# Altium project bailey.PrjPcb (part 6 of 11)
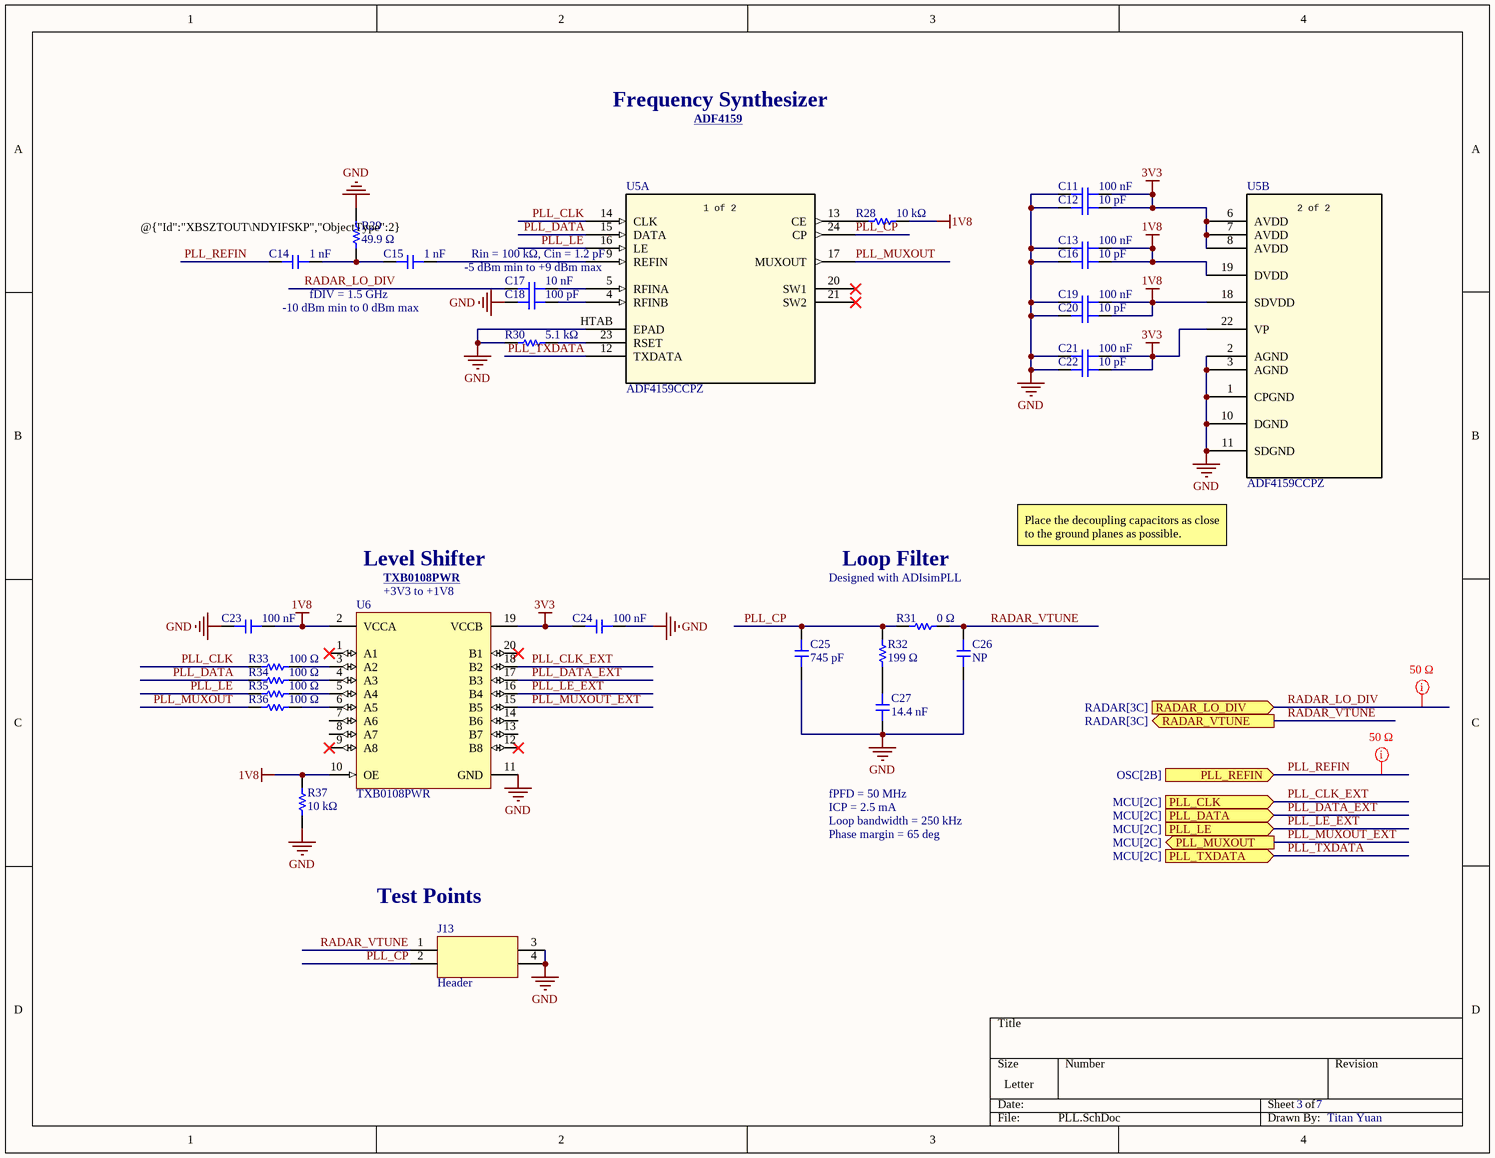
[diagram p11: PLL.SchDoc]

## Sheet PLL.SchDoc (continued)

### Library data of the parts (continued)
U5 = ADF4159CCPZ: IC Pll Freq Synthesizer 24LFCSP "IC 13GHZ 1 24-WFQFN Exposed Pad, Csp"; Manufacturer_Name: Analog Devices Inc; Manufacturer: Analog Devices; Manufacturer Lifecycle Status: PRODUCTION; Input: CMOS; Max Supply Current: 40mA; Max Supply Voltage: 3.45V; Min Supply Voltage: 2.7V; Nominal Supply Current: 33mA; Number of Circuits: 1; PLL: Yes; Copyright: Copyright (C) 2025 Ultra Librarian. All rights reserved.; Manufacturer_Part_Number: ADF4159CCPZ; RefDes: RefDes; Type: Type; Supplier: Arrow Electronics; Supplier Part Number: ADF4159CCPZ; Manufacturer Part Number: ADF4159CCPZ; RoHS: Compliant; Category: Clock Generators, PLLs, Frequency Synthesizers; Stock: 16; Pricing: 1=14.01, 10=12.76 (USD); Case/Package: LFCSP EP; Frequency: 13GHz; Height: 750µm; Lead Free: Contains Lead; Length: 4.1mm; Lifecycle Status: Production; Clock Frequency: 13GHz; Max Operating Temperature: 125°C; Min Operating Temperature: -40°C; Mounting Technology: Surface Mount; Number of Outputs: 1; Pins: 24; Operating Supply Current: 40mA; Radiation Hardening: No; REACH SVHC: No; Schedule B: 8542390000, 8542390000|8542390000|8542390000|8542390000|8542390000|8542390000|8542390000|8542390000|8542390000|8542390000|8542390000|8542390000|8542390000|8542390000|8542390000|8542390000|8542390000|8542390000|8542390000|8542390000|8542390000|8542390000|8542390000|85; Width: 4.1mm; ComponentLink1URL: https://datasheet.octopart.com:443/ADF4159CCPZ-Analog-Devices-datasheet-28359207.pdf?src-supplier=Newark; ComponentLink1Description: https://datasheet.octopart.com:443/ADF4159CCPZ-Analog-Devices-datasheet-28359207.pdf?src-supplier=Newark; ComponentLink2URL: https://datasheet.octopart.com:443/ADF4159CCPZ-Analog-Devices-datasheet-23761417.pdf?src-supplier=Newark; ComponentLink2Description: https://datasheet.octopart.com:443/ADF4159CCPZ-Analog-Devices-datasheet-23761417.pdf?src-supplier=Newark; ComponentLink3URL: https://datasheet.octopart.com:443/ADF4159CCPZ-Analog-Devices-datasheet-11761967.pdf?src-supplier=Newark; ComponentLink3Description: https://datasheet.octopart.com:443/ADF4159CCPZ-Analog-Devices-datasheet-11761967.pdf?src-supplier=Newark; ComponentLink4URL: https://octopart.com:443/opatz8j6/c1?t=sFpxmdEK-TpWxew3lQPHWXAdM5czz84jkTjdAblxL2FLtgSnnJtHzcZ7eDVrY5wUr_SVqsz_Dp2fz8ZtN6lVO8uzYTTInUBy26MK382qZeiAUDaS88UR4ELIN2ZU7XFIVaK4UL8ObL4flxWtc7ks8pYJfkdBDqO7QR7iH-p_7135f50wuHOzpbmA4pBW-bckYVq5mgo5pYPHvD0dMhS4_c77dJySLl7uu4XVnigltr6SOw_ybHZCS7HIqQ2lc5ypX2E6NLk_TCC2erJi_2-Ybzi1S5UkxB_CfPGHcszzu0v9JbzFJPfherc&src-supplier=Analog+Devices; ComponentLink4Description: https://octopart.com:443/opatz8j6/c1?t=sFpxmdEK-TpWxew3lQPHWXAdM5czz84jkTjdAblxL2FLtgSnnJtHzcZ7eDVrY5wUr_SVqsz_Dp2fz8ZtN6lVO8uzYTTInUBy26MK382qZeiAUDaS88UR4ELIN2ZU7XFIVaK4UL8ObL4flxWtc7ks8pYJfkdBDqO7QR7iH-p_7135f50wuHOzpbmA4pBW-bckYVq5mgo5pYPHvD0dMhS4_c77dJySLl7uu4XVnigltr6SOw_ybHZCS7HIqQ2lc5ypX2E6NLk_TCC2erJi_2-Ybzi1S5UkxB_CfPGHcszzu0v9JbzFJPfherc&src-supplier=Analog+Devices; ComponentLink5URL: https://datasheet.octopart.com:443/ADF4159CCPZ-Analog-Devices-datasheet-101563325.pdf?src-supplier=Augswan; ComponentLink5Description: https://datasheet.octopart.com:443/ADF4159CCPZ-Analog-Devices-datasheet-101563325.pdf?src-supplier=Augswan; ComponentLink6URL: https://datasheet.octopart.com:443/ADF4159CCPZ-Analog-Devices-datasheet-16077098.pdf?src-supplier=element14+APAC; ComponentLink6Description: https://datasheet.octopart.com:443/ADF4159CCPZ-Analog-Devices-datasheet-16077098.pdf?src-supplier=element14+APAC; ComponentLink7URL: https://datasheet.octopart.com:443/ADF4159CCPZ-Analog-Devices-datasheet-140566762.pdf?src-supplier=Arrow.cn; ComponentLink7Description: https://datasheet.octopart.com:443/ADF4159CCPZ-Analog-Devices-datasheet-140566762.pdf?src-supplier=Arrow.cn; ComponentLink8URL: http://sigma.octopart.com:80/conflict_mineral_statement/Analog-Devices-company-33.pdf?src-supplier=Compliance+Statements; ComponentLink8Description: http://sigma.octopart.com:80/conflict_mineral_statement/Analog-Devices-company-33.pdf?src-supplier=Compliance+Statements; ComponentLink9URL: https://octopart.com:443/opatz8j6/c1?t=4AUWQOYY8hDK56fWYIFCkzZGK-WlRlfj3W59qJ6lN0Or0dqBi-BZtouAdLLcZ0g9GpUibARjvwKelFok923HesNjOwvjJbGuJIFFDtkFLQoAtw9O0oSsPiBrvEsgVLQ8yyZZa0MUOvDC9pb6dfm0a_5Zj_Vp7K3DrxroK-yAUp5WMn8ukNugC5wnzgVIb4QKMMJ7PwoxZFfV1QgXJzgUp4ZWxSHfn6Mn-DyBM67ES7wx5acptrPz2a-iVPxqbhd_bTw80SeUQ9yQIgwDbxKtCFSTQqp_tPFf7XLfJysxGOlPYb3Go66K7jI&src-supplier=Compliance+Statements; ComponentLink9Description: https://octopart.com:443/opatz8j6/c1?t=4AUWQOYY8hDK56fWYIFCkzZGK-WlRlfj3W59qJ6lN0Or0dqBi-BZtouAdLLcZ0g9GpUibARjvwKelFok923HesNjOwvjJbGuJIFFDtkFLQoAtw9O0oSsPiBrvEsgVLQ8yyZZa0MUOvDC9pb6dfm0a_5Zj_Vp7K3DrxroK-yAUp5WMn8ukNugC5wnzgVIb4QKMMJ7PwoxZFfV1QgXJzgUp4ZWxSHfn6Mn-DyBM67ES7wx5acptrPz2a-iVPxqbhd_bTw80SeUQ9yQIgwDbxKtCFSTQqp_tPFf7XLfJysxGOlPYb3Go66K7jI&src-supplier=Compliance+Statements
U6 = TXB0108PWR: 8-Bit Bidirectional Voltage-Level Shifter with Auto Direction Sensing and +/-15-kV ESD Protect 20-TSSOP -40 to 85; Manufacturer: Texas Instruments; Manufacturer Lifecycle Status: ACTIVE; Manufacturer Package Identifier: PW (R-PDSO-G**); Data Rate: 100Mbps; High Level Output Current: -20µA; Logic Function: Translator; Low Level Output Current: 20µA; Max Supply Voltage: 5.5V; Min Supply Voltage: 1.65V; Number of Bits: 8; Propagation Delay: 4ns; Quiescent Current: 3.5µA; Rise Time: 7.3ns; Topology: Push-Pull; Turn-On Delay Time: 9.5ns; Manufacturer Part Number: TXB0108PWR; Supplier: DigiKey; Supplier Part Number: 296-21527-1-ND; RoHS: Compliant; Category: Voltage Level Shifters; Stock: 22043; Pricing: 1=1.82, 10=1.338, 25=1.2176, 100=1.0851, 250=1.02184, 500=1.01132 (USD); Case/Package: TSSOP; Contact Plating: Gold; Height: 0m; Lead Free: Lead Free; Length: 6.5mm; Lifecycle Status: Production; Max Operating Temperature: 85°C; Min Operating Temperature: -40°C; Mounting Technology: Surface Mount; Number of Channels: 8; Number of Inputs: 8; Pins: 20; Output Current: 20µA; Radiation Hardening: No; REACH SVHC: No; Schedule B: 8542390000, 8542390000|8542390000|8542390000|8542390000|8542390000; Termination: SMD/SMT; Thickness: 1mm; Weight: 76.997305mg; Width: 4.4mm; ComponentLink1URL: https://sigma.octopart.com:443/157851284/technical_drawing/Texas-Instruments-TXB0108PWR.pdf?src-supplier=Texas+Instruments; ComponentLink1Description: https://sigma.octopart.com:443/157851284/technical_drawing/Texas-Instruments-TXB0108PWR.pdf?src-supplier=Texas+Instruments; ComponentLink2URL: https://octopart.com:443/opatz8j6/c1?t=LySuUYxN9QFMmqSZ0iSTBK1M-CfND3iA45F57-rgipnbsICCknTkoBhUukg2AkZDEL0aXzWd55iRogxa7qKL4TXUNFi6ipSyGXAAa9LZBdmP_Kv4vGBHh0qj-vgKaBFsF-d5KwYEI23cSnz-pp69Sgcy-_vsa0CB7mKhHXjctGx33TVX4QZBqIYpXxZkCgRNByv7fiJueXud0UX45YityO0p_-WYUGRJV_eJOGa4Ay7QQ8FZc3uEUNlVrkxXjQZMNFnbfnrSKCgesFBqhoNiKT25AC3yNUdmgJ7FLN5_z4zOzP0RR75DYkH4GMBnBzaYVRF7L7HNXVjS4Tp9-MFjD_sEQ-aCybQglHE52PnZL4JsgTDjFwelFwDtaMk_UKSdWjy_&src-supplier=Texas+Instruments; ComponentLink2Description: https://octopart.com:443/opatz8j6/c1?t=LySuUYxN9QFMmqSZ0iSTBK1M-CfND3iA45F57-rgipnbsICCknTkoBhUukg2AkZDEL0aXzWd55iRogxa7qKL4TXUNFi6ipSyGXAAa9LZBdmP_Kv4vGBHh0qj-vgKaBFsF-d5KwYEI23cSnz-pp69Sgcy-_vsa0CB7mKhHXjctGx33TVX4QZBqIYpXxZkCgRNByv7fiJueXud0UX45YityO0p_-WYUGRJV_eJOGa4Ay7QQ8FZc3uEUNlVrkxXjQZMNFnbfnrSKCgesFBqhoNiKT25AC3yNUdmgJ7FLN5_z4zOzP0RR75DYkH4GMBnBzaYVRF7L7HNXVjS4Tp9-MFjD_sEQ-aCybQglHE52PnZL4JsgTDjFwelFwDtaMk_UKSdWjy_&src-supplier=Texas+Instruments; ComponentLink3URL: https://datasheet.octopart.com:443/TXB0108PWR-Texas-Instruments-datasheet-34148259.pdf?src-supplier=Texas+Instruments; ComponentLink3Description: https://datasheet.octopart.com:443/TXB0108PWR-Texas-Instruments-datasheet-34148259.pdf?src-supplier=Texas+Instruments; ComponentLink4URL: https://datasheet.octopart.com:443/TXB0108PWR-Texas-Instruments-datasheet-11474939.pdf?src-supplier=Texas+Instruments; ComponentLink4Description: https://datasheet.octopart.com:443/TXB0108PWR-Texas-Instruments-datasheet-11474939.pdf?src-supplier=Texas+Instruments; ComponentLink5URL: https://datasheet.octopart.com:443/TXB0108PWR-Texas-Instruments-datasheet-10384694.pdf?src-supplier=Texas+Instruments; ComponentLink5Description: https://datasheet.octopart.com:443/TXB0108PWR-Texas-Instruments-datasheet-10384694.pdf?src-supplier=Texas+Instruments; ComponentLink6URL: https://datasheet.octopart.com:443/TXB0108PWR-Texas-Instruments-datasheet-10258393.pdf?src-supplier=Texas+Instruments; ComponentLink6Description: https://datasheet.octopart.com:443/TXB0108PWR-Texas-Instruments-datasheet-10258393.pdf?src-supplier=Texas+Instruments; ComponentLink7URL: https://sigma.octopart.com:443/49249835/technical_drawing/Texas-Instruments-TXB0108PWR.pdf?src-supplier=Texas+Instruments; ComponentLink7Description: https://sigma.octopart.com:443/49249835/technical_drawing/Texas-Instruments-TXB0108PWR.pdf?src-supplier=Texas+Instruments; ComponentLink8URL: https://datasheet.octopart.com:443/TXB0108PWR-Texas-Instruments-datasheet-37744618.pdf?src-supplier=Farnell; ComponentLink8Description: https://datasheet.octopart.com:443/TXB0108PWR-Texas-Instruments-datasheet-37744618.pdf?src-supplier=Farnell; ComponentLink9URL: https://datasheet.octopart.com:443/TXB0108PWR-Texas-Instruments-datasheet-8559414.pdf?src-supplier=Farnell; ComponentLink9Description: https://datasheet.octopart.com:443/TXB0108PWR-Texas-Instruments-datasheet-8559414.pdf?src-supplier=Farnell; ComponentLink10URL: https://datasheet.octopart.com:443/TXB0108PWR-Texas-Instruments-datasheet-5368061.pdf?src-supplier=Farnell; ComponentLink10Description: https://datasheet.octopart.com:443/TXB0108PWR-Texas-Instruments-datasheet-5368061.pdf?src-supplier=Farnell; ComponentLink11URL: https://datasheet.octopart.com:443/TXB0108PWR-Texas-Instruments-datasheet-66618004.pdf?src-supplier=Farnell; ComponentLink11Description: https://datasheet.octopart.com:443/TXB0108PWR-Texas-Instruments-datasheet-66618004.pdf?src-supplier=Farnell; ComponentLink12URL: https://datasheet.octopart.com:443/TXB0108PWR-Texas-Instruments-datasheet-48033010.pdf?src-supplier=Farnell; ComponentLink12Description: https://datasheet.octopart.com:443/TXB0108PWR-Texas-Instruments-datasheet-48033010.pdf?src-supplier=Farnell; ComponentLink13URL: https://datasheet.octopart.com:443/TXB0108PWR-Texas-Instruments-datasheet-10542789.pdf?src-supplier=Farnell; ComponentLink13Description: https://datasheet.octopart.com:443/TXB0108PWR-Texas-Instruments-datasheet-10542789.pdf?src-supplier=Farnell; ComponentLink14URL: https://datasheet.octopart.com:443/TXB0108PWR-Texas-Instruments-datasheet-151942.pdf?src-supplier=Upverter; ComponentLink14Description: https://datasheet.octopart.com:443/TXB0108PWR-Texas-Instruments-datasheet-151942.pdf?src-supplier=Upverter; ComponentLink15URL: https://datasheet.octopart.com:443/TXB0108PWR-Texas-Instruments-datasheet-11536343.pdf?src-supplier=Upverter; ComponentLink15Description: https://datasheet.octopart.com:443/TXB0108PWR-Texas-Instruments-datasheet-11536343.pdf?src-supplier=Upverter; ComponentLink16URL: https://datasheet.octopart.com:443/TXB0108PWR-Texas-Instruments-datasheet-33012939.pdf?src-supplier=element14+APAC; ComponentLink16Description: https://datasheet.octopart.com:443/TXB0108PWR-Texas-Instruments-datasheet-33012939.pdf?src-supplier=element14+APAC; ComponentLink17URL: https://datasheet.octopart.com:443/TXB0108PWR-Texas-Instruments-datasheet-165804950.pdf?src-supplier=LCSC; ComponentLink17Description: https://datasheet.octopart.com:443/TXB0108PWR-Texas-Instruments-datasheet-165804950.pdf?src-supplier=LCSC; ComponentLink18URL: https://datasheet.octopart.com:443/TXB0108PWR-Texas-Instruments-datasheet-159118386.pdf?src-supplier=LCSC; ComponentLink18Description: https://datasheet.octopart.com:443/TXB0108PWR-Texas-Instruments-datasheet-159118386.pdf?src-supplier=LCSC; ComponentLink19URL: https://datasheet.octopart.com:443/TXB0108PWR-Texas-Instruments-datasheet-137316104.pdf?src-supplier=Future+Electronics; ComponentLink19Description: https://datasheet.octopart.com:443/TXB0108PWR-Texas-Instruments-datasheet-137316104.pdf?src-supplier=Future+Electronics; ComponentLink20URL: https://datasheet.octopart.com:443/TXB0108PWR-Texas-Instruments-datasheet-14151550.pdf?src-supplier=iiiC; ComponentLink20Description: https://datasheet.octopart.com:443/TXB0108PWR-Texas-Instruments-datasheet-14151550.pdf?src-supplier=iiiC; ComponentLink21URL: https://datasheet.octopart.com:443/TXB0108PWR-Texas-Instruments-datasheet-126938.pdf?src-supplier=DigiKey; ComponentLink21Description: https://datasheet.octopart.com:443/TXB0108PWR-Texas-Instruments-datasheet-126938.pdf?src-supplier=DigiKey; ComponentLink22URL: http://sigma.octopart.com:80/reach_statement/Texas-Instruments-company-64.pdf?src-supplier=Compliance+Statements; ComponentLink22Description: http://sigma.octopart.com:80/reach_statement/Texas-Instruments-company-64.pdf?src-supplier=Compliance+Statements; ComponentLink23URL: http://sigma.octopart.com:80/conflict_mineral_statement/Texas-Instruments-company-63.pdf?src-supplier=Compliance+Statements; ComponentLink23Description: http://sigma.octopart.com:80/conflict_mineral_statement/Texas-Instruments-company-63.pdf?src-supplier=Compliance+Statements

## Sheet ADC.SchDoc
size Letter; DrawnBy: Titan Yuan; DocumentNumber: 4; SheetNumber: 4; SheetTotal: 7
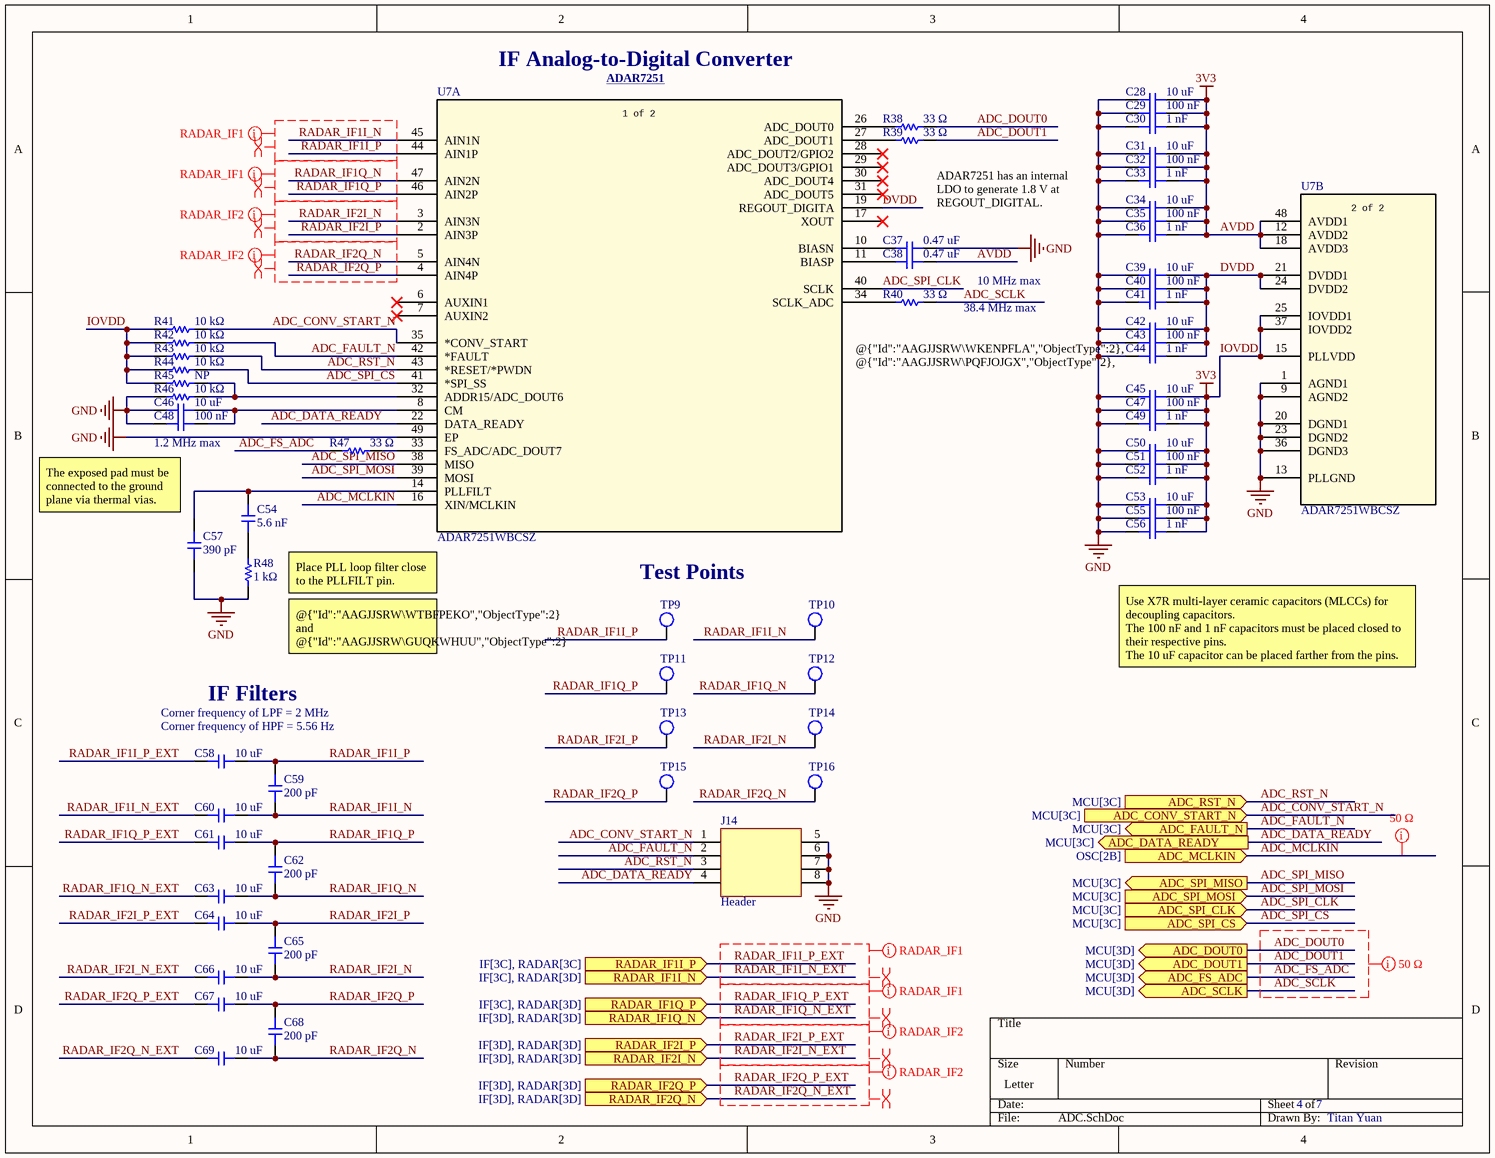
[diagram p3: ADC.SchDoc]

### Parts
C28  10 uF  [CAP_0805]
C29  100 nF  [CAP_0402]
C30  1 nF  [CAP_0402]
C31  10 uF  [CAP_0805]
C32  100 nF  [CAP_0402]
C33  1 nF  [CAP_0402]
C34  10 uF  [CAP_0805]
C35  100 nF  [CAP_0402]
C36  1 nF  [CAP_0402]
C37  0.47 uF  [CAP_0402]
C38  0.47 uF  [CAP_0402]
C39  10 uF  [CAP_0805]
C40  100 nF  [CAP_0402]
C41  1 nF  [CAP_0402]
C42  10 uF  [CAP_0805]
C43  100 nF  [CAP_0402]
C44  1 nF  [CAP_0402]
C45  10 uF  [CAP_0805]
C46  10 uF  [CAP_0805]
C47  100 nF  [CAP_0402]
C48  100 nF  [CAP_0402]
C49  1 nF  [CAP_0402]
C50  10 uF  [CAP_0805]
C51  100 nF  [CAP_0402]
C52  1 nF  [CAP_0402]
C53  10 uF  [CAP_0805]
C54  5.6 nF  [CAP_0402]
C55  100 nF  [CAP_0402]
C56  1 nF  [CAP_0402]
C57  390 pF  [CAP_0402]
C58  10 uF  [CAP_0805]
C59  200 pF  [CAP_0603]
C60  10 uF  [CAP_0805]
C61  10 uF  [CAP_0805]
C62  200 pF  [CAP_0603]
C63  10 uF  [CAP_0805]
C64  10 uF  [CAP_0805]
C65  200 pF  [CAP_0603]
C66  10 uF  [CAP_0805]
C67  10 uF  [CAP_0805]
C68  200 pF  [CAP_0603]
C69  10 uF  [CAP_0805]
J14  Header  [CONN_2x4_2.54mm_PinHeader_Vertical]
R38  33 Ω  [RES_0402]
R39  33 Ω  [RES_0402]
R40  33 Ω  [RES_0402]
R41  10 kΩ  [RES_0402]
R42  10 kΩ  [RES_0402]
R43  10 kΩ  [RES_0402]
R44  10 kΩ  [RES_0402]
R45  NP  [RES_0402]
R46  10 kΩ  [RES_0402]
R47  33 Ω  [RES_0402]
R48  1 kΩ  [RES_0402]
TP9  TEST_POINT  [TEST_POINT]  (value not drawn)
TP10  TEST_POINT  [TEST_POINT]  (value not drawn)
TP11  TEST_POINT  [TEST_POINT]  (value not drawn)
TP12  TEST_POINT  [TEST_POINT]  (value not drawn)
TP13  TEST_POINT  [TEST_POINT]  (value not drawn)
TP14  TEST_POINT  [TEST_POINT]  (value not drawn)
TP15  TEST_POINT  [TEST_POINT]  (value not drawn)
TP16  TEST_POINT  [TEST_POINT]  (value not drawn)
U7  ADAR7251WBCSZ  [CS_48_1_ADI]  (parts A,B of 2)

### Ports
ADC_CONV_START_N (in, see MCU[3C]), ADC_DATA_READY (out, see MCU[3C]), ADC_DOUT0 (out, see MCU[3D]), ADC_DOUT1 (out, see MCU[3D]), ADC_FAULT_N (out, see MCU[3C]), ADC_FS_ADC (out, see MCU[3D]), ADC_MCLKIN (in, see OSC[2B]), ADC_RST_N (in, see MCU[3C]), ADC_SCLK (out, see MCU[3D]), ADC_SPI_CLK (in, see MCU[3C]), ADC_SPI_CS (in, see MCU[3C]), ADC_SPI_MISO (out, see MCU[3C]), ADC_SPI_MOSI (in, see MCU[3C]), RADAR_IF1I_N (in, see IF[3C], RADAR[3D]), RADAR_IF1I_P (in, see IF[3C], RADAR[3C]), RADAR_IF1Q_N (in, see IF[3D], RADAR[3D]), RADAR_IF1Q_P (in, see IF[3C], RADAR[3D]), RADAR_IF2I_N (in, see IF[3D], RADAR[3D]), RADAR_IF2I_P (in, see IF[3D], RADAR[3D]), RADAR_IF2Q_N (in, see IF[3D], RADAR[3D]), RADAR_IF2Q_P (in, see IF[3D], RADAR[3D])

### Nets
AVDD: C28.2 C29.2 C30.2 C31.2 C32.2 C33.2 C34.2 C35.2 C36.2 C38.1 C45.2 C47.2 C49.2 C50.2 C51.2 C52.2 C53.2 C55.2 C56.2 R41.2 R42.2 R43.2 R44.2 R45.2 U7.12(AVDD2) U7.15(PLLVDD) U7.18(AVDD3) U7.25(IOVDD1) U7.37(IOVDD2) U7.48(AVDD1)  [also labelled 3V3, IOVDD]
GND: C28.1 C29.1 C30.1 C31.1 C32.1 C33.1 C34.1 C35.1 C36.1 C37.1 C39.1 C40.1 C41.1 C42.1 C43.1 C44.1 C45.1 C46.1 C47.1 C48.1 C49.1 C50.1 C51.1 C52.1 C53.1 C55.1 C56.1 C57.1 J14.5 J14.6 J14.7 J14.8 R46.2 R48.1 U7.1(AGND1) U7.9(AGND2) U7.13(PLLGND) U7.20(DGND1) U7.23(DGND2) U7.36(DGND3) U7.49(EP)
ADC_CONV_START_N: J14.1 R41.1 U7.35(*CONV_START) ; port ADC_CONV_START_N
ADC_DATA_READY: J14.4 U7.22(DATA_READY) ; port ADC_DATA_READY
ADC_DOUT0: R38.2 ; port ADC_DOUT0
ADC_DOUT1: R39.2 ; port ADC_DOUT1
ADC_FAULT_N: J14.2 R42.1 U7.42(*FAULT) ; port ADC_FAULT_N
ADC_FS_ADC: R47.1 ; port ADC_FS_ADC
ADC_MCLKIN: U7.16(XIN/MCLKIN) ; port ADC_MCLKIN
ADC_RST_N: J14.3 R43.1 U7.43(*RESET/*PWDN) ; port ADC_RST_N
ADC_SCLK: R40.2 ; port ADC_SCLK
ADC_SPI_CLK: U7.40(SCLK) ; port ADC_SPI_CLK
ADC_SPI_CS: R44.1 U7.41(*SPI_SS) ; port ADC_SPI_CS
ADC_SPI_MISO: U7.38(MISO) ; port ADC_SPI_MISO
ADC_SPI_MOSI: U7.39(MOSI) ; port ADC_SPI_MOSI
DVDD: C39.2 C40.2 C41.2 C42.2 C43.2 C44.2 U7.19(REGOUT_DIGITA) U7.21(DVDD1) U7.24(DVDD2)  [project net DVDD_4]
RADAR_IF1I_N: C59.1 C60.2 TP10.1 U7.45(AIN1N)  [project net RADAR_IF1I_N_4]
RADAR_IF1I_N_EXT: C60.1 ; port RADAR_IF1I_N  [project net RADAR_IF1I_N]
RADAR_IF1I_P: C58.2 C59.2 TP9.1 U7.44(AIN1P)  [project net RADAR_IF1I_P_4]
RADAR_IF1I_P_EXT: C58.1 ; port RADAR_IF1I_P  [project net RADAR_IF1I_P]
RADAR_IF1Q_N: C62.1 C63.2 TP12.1 U7.47(AIN2N)  [project net RADAR_IF1Q_N_4]
RADAR_IF1Q_N_EXT: C63.1 ; port RADAR_IF1Q_N  [project net RADAR_IF1Q_N]
RADAR_IF1Q_P: C61.2 C62.2 TP11.1 U7.46(AIN2P)  [project net RADAR_IF1Q_P_4]
RADAR_IF1Q_P_EXT: C61.1 ; port RADAR_IF1Q_P  [project net RADAR_IF1Q_P]
RADAR_IF2I_N: C65.1 C66.2 TP14.1 U7.3(AIN3N)  [project net RADAR_IF2I_N_4]
RADAR_IF2I_N_EXT: C66.1 ; port RADAR_IF2I_N  [project net RADAR_IF2I_N]
RADAR_IF2I_P: C64.2 C65.2 TP13.1 U7.2(AIN3P)  [project net RADAR_IF2I_P_4]
RADAR_IF2I_P_EXT: C64.1 ; port RADAR_IF2I_P  [project net RADAR_IF2I_P]
RADAR_IF2Q_N: C68.1 C69.2 TP16.1 U7.5(AIN4N)  [project net RADAR_IF2Q_N_4]
RADAR_IF2Q_N_EXT: C69.1 ; port RADAR_IF2Q_N  [project net RADAR_IF2Q_N]
RADAR_IF2Q_P: C67.2 C68.2 TP15.1 U7.4(AIN4P)  [project net RADAR_IF2Q_P_4]
RADAR_IF2Q_P_EXT: C67.1 ; port RADAR_IF2Q_P  [project net RADAR_IF2Q_P]
NetC37_2: C37.2 U7.10(BIASN)
NetC38_2: C38.2 U7.11(BIASP)
NetC46_2: C46.2 C48.2 U7.8(CM)
NetC54_1: C54.1 R48.2
NetC54_2: C54.2 C57.2 U7.14(PLLFILT)
NetR38_1: R38.1 U7.26(ADC_DOUT0)
NetR39_1: R39.1 U7.27(ADC_DOUT1)
NetR40_1: R40.1 U7.34(SCLK_ADC)
NetR45_1: R45.1 R46.1 U7.32(ADDR15/ADC_DOUT6)
NetR47_2: R47.2 U7.33(FS_ADC/ADC_DOUT7)

Not connected (* = marked no-connect by the designer): U7 6(AUXIN1)* 7(AUXIN2)* 17(XOUT)* 28(ADC_DOUT2/GPIO2)* 29(ADC_DOUT3/GPIO1)* 30(ADC_DOUT4)* 31(ADC_DOUT5)*

### Layout directives
net class 50 Ω: ADC_DOUT0, ADC_DOUT1, ADC_FS_ADC, ADC_MCLKIN, ADC_SCLK
differential pair: RADAR_IF1I_N, RADAR_IF1I_N_EXT, RADAR_IF1I_P, RADAR_IF1I_P_EXT, RADAR_IF1Q_N, RADAR_IF1Q_N_EXT, RADAR_IF1Q_P, RADAR_IF1Q_P_EXT, RADAR_IF2I_N, RADAR_IF2I_N_EXT, RADAR_IF2I_P, RADAR_IF2I_P_EXT, RADAR_IF2Q_N, RADAR_IF2Q_N_EXT, RADAR_IF2Q_P, RADAR_IF2Q_P_EXT
mark named RADAR_IF1: RADAR_IF1I_N, RADAR_IF1I_N_EXT, RADAR_IF1I_P, RADAR_IF1I_P_EXT, RADAR_IF1Q_N, RADAR_IF1Q_N_EXT, RADAR_IF1Q_P, RADAR_IF1Q_P_EXT
mark named RADAR_IF2: RADAR_IF2I_N, RADAR_IF2I_N_EXT, RADAR_IF2I_P, RADAR_IF2I_P_EXT, RADAR_IF2Q_N, RADAR_IF2Q_N_EXT, RADAR_IF2Q_P, RADAR_IF2Q_P_EXT

### Notes on the sheet
- IF Analog-to-Digital Converter
- (near U7) ADAR7251 <https://www.analog.com/en/products/adar7251.html>
- ADAR7251 has an internal LDO to generate 1.8 V at REGOUT_DIGITAL.
- 10 MHz max
- (near U7) @{"Id":"AAGJJSRW\WKENPFLA","ObjectType":2}, @{"Id":"AAGJJSRW\PQFJOJGX","ObjectType":2}, @{"Id":"AAGJJSRW\MFIUAKVZ","ObjectType":2}, and @{"Id":"AAGJJSRW\DOLTHUHP","ObjectType":2} serve to damp the fast edges of the digital signals.
- 38.4 MHz max
- The exposed pad must be connected to the ground plane via thermal vias.
- (near C48) 1.2 MHz max
- Place PLL loop filter close to the PLLFILT pin.
- Test Points
- IF Filters
- (near R48) @{"Id":"AAGJJSRW\WTBFPEKO","ObjectType":2} and @{"Id":"AAGJJSRW\GUQKWHUU","ObjectType":2} must be NPO type for best temperature performance.
- Use X7R multi-layer ceramic capacitors (MLCCs) for decoupling capacitors.
  The 100 nF and 1 nF capacitors must be placed closed to their respective pins.
  The 10 uF capacitor can be placed farther from the pins.
- Corner frequency of LPF = 2 MHz
- Corner frequency of HPF = 5.56 Hz
- (in symbol ADAR7251WBCSZ, part A) 1 of 2
- (in symbol ADAR7251WBCSZ, part B) 2 of 2